# EasyEDA Pro project GD25Q40ETIGR.eprj

# Schematic Schematic1
Board Name: Board1; Create Date: 2025-05-31; Page Name: P1; Project Name: GD25Q40ETIGR; Schematic Name: Schematic1; Update Date: 2025-05-31; Company: Dawn; Drawed: Dawn; Page Size: A4; Version: V1.0
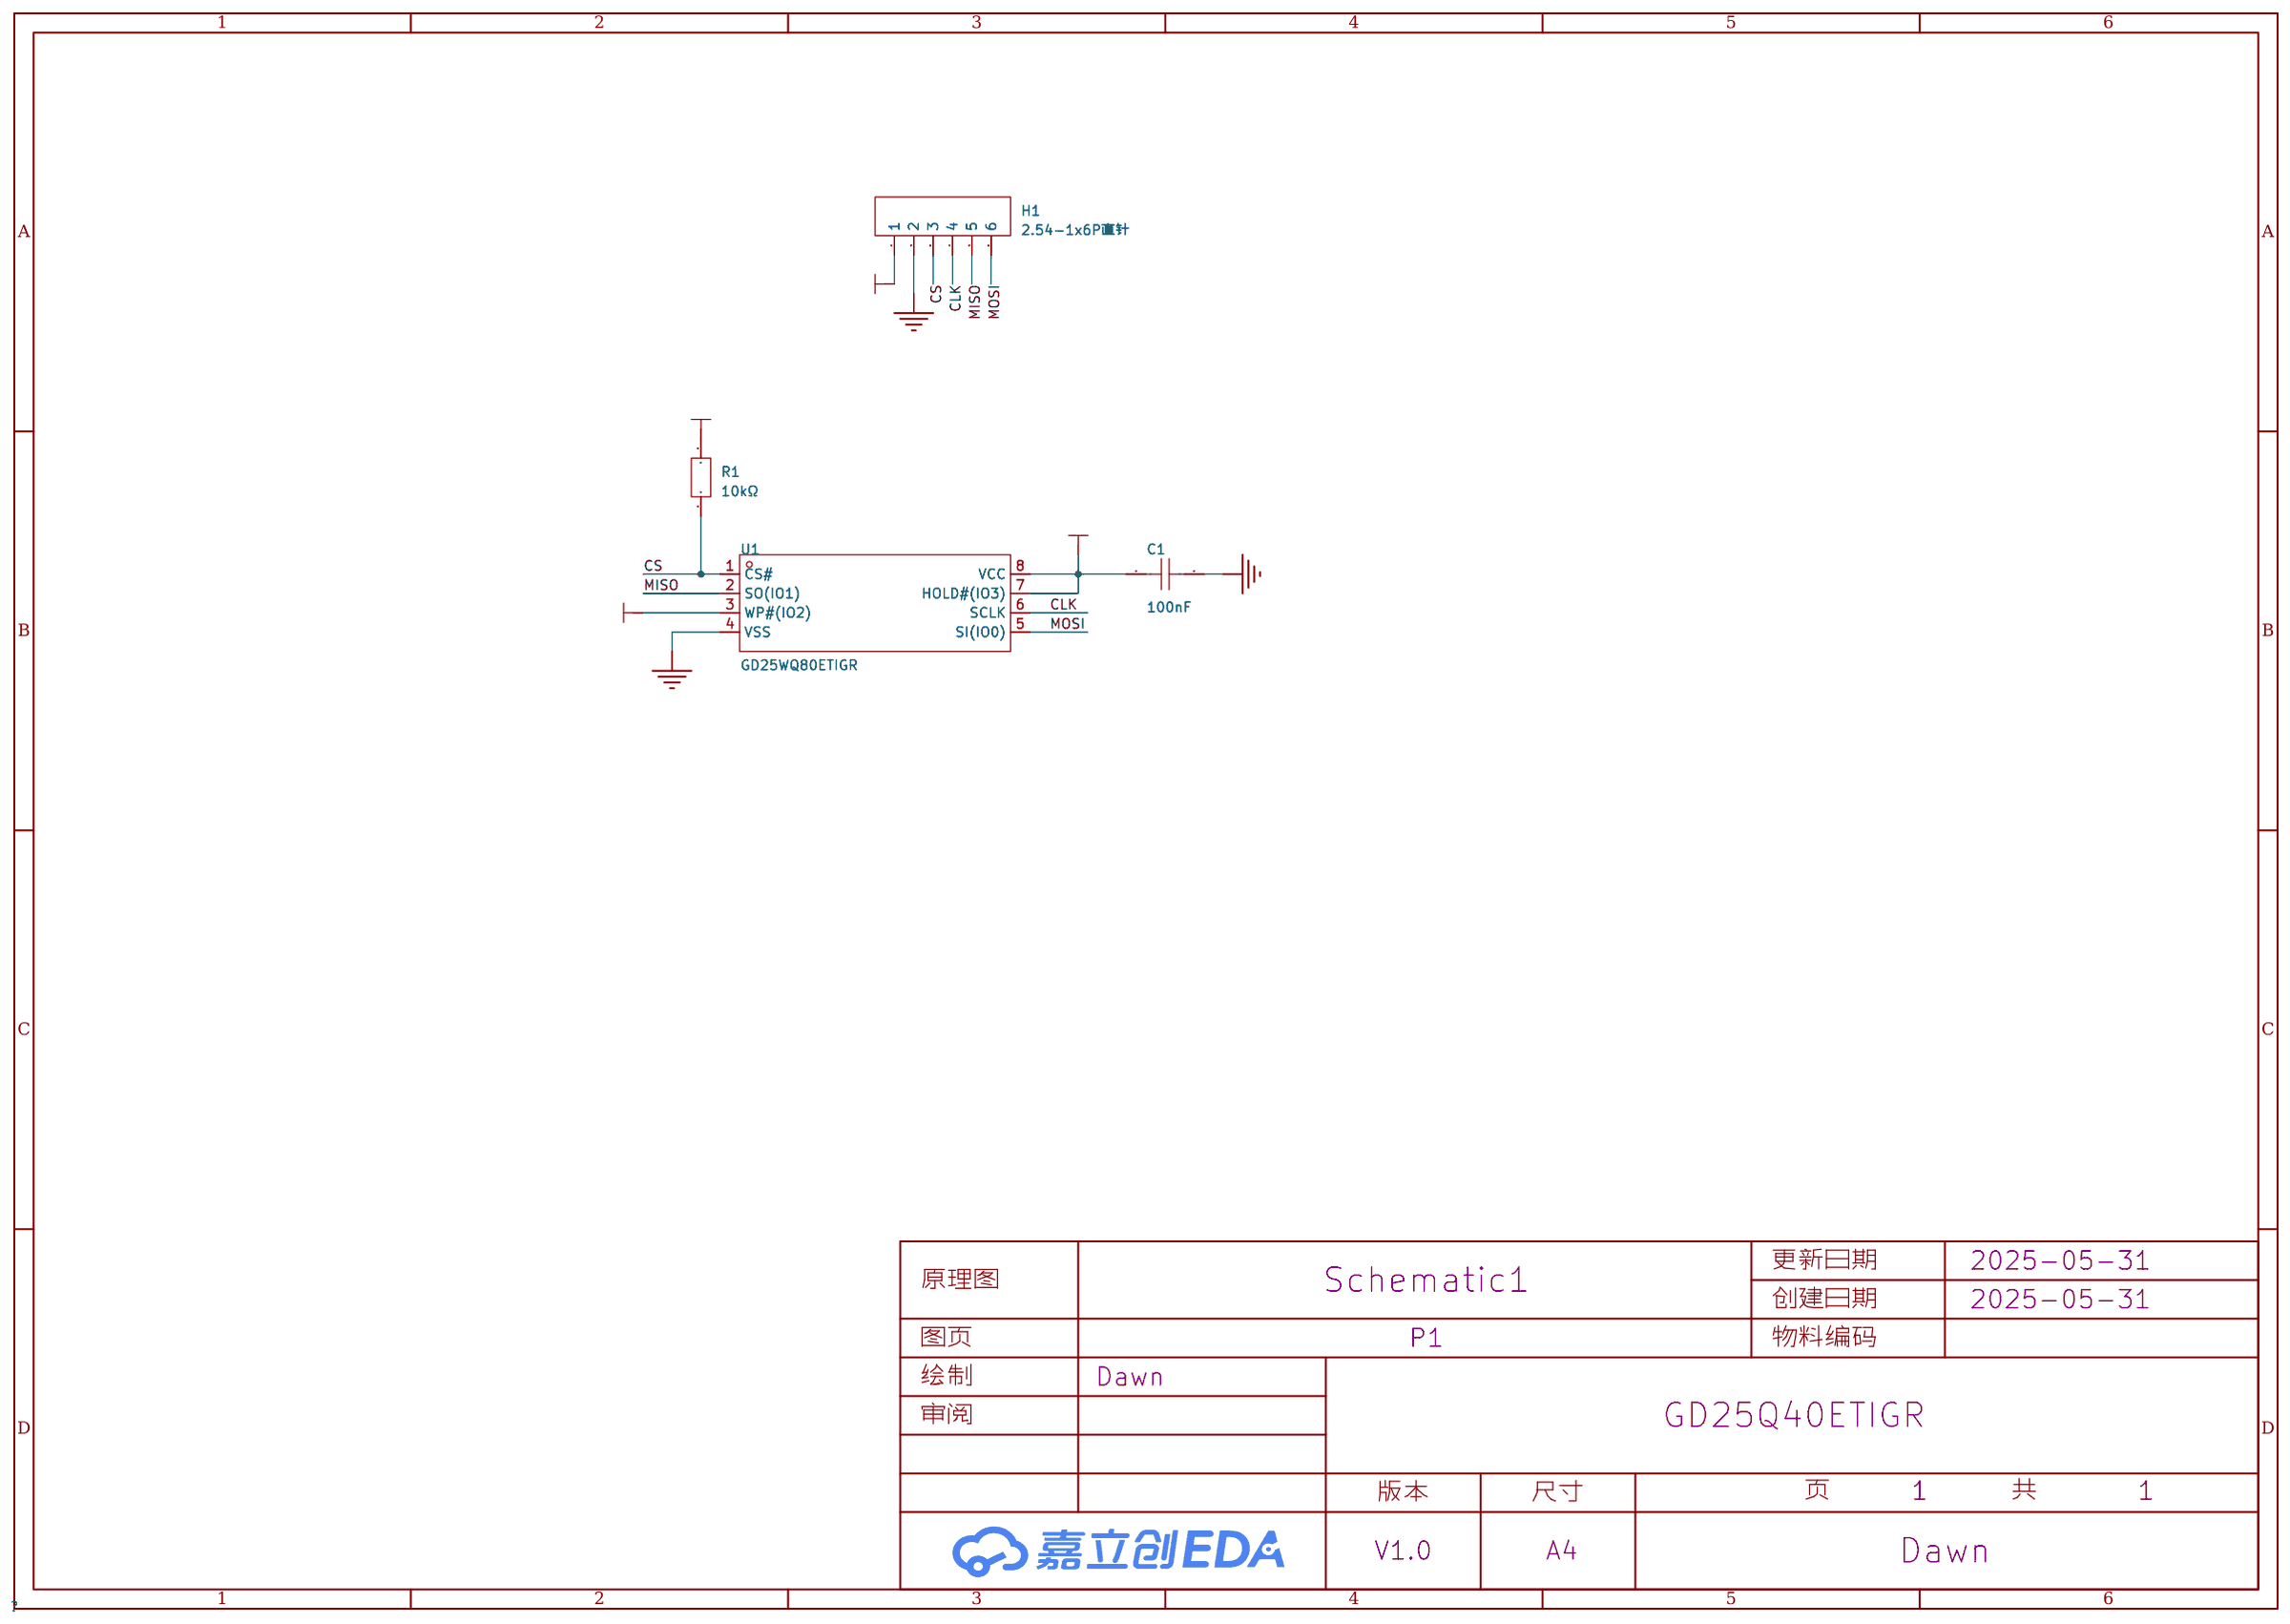
[diagram p0: schematic sheet]

## Parts
C1  100nF  [C0603]
H1  2.54-1x6P直针  [HDR-TH_6P-P2.54-V-M-1]
R1  10kΩ  [R0805]
U1  GD25WQ80ETIGR  [SOIC-8_L4.9-W3.9-P1.27-LS6.0-BL]

## Library data of the parts
C1 = CGA0603X7R104K500JT: LCSC Part Name: 100nF ±10% 50V; Supplier Part: C6119867; Manufacturer: HRE(芯声); Supplier Footprint: 0603; JLCPCB Part Class: 扩展库; Datasheet: https://atta.szlcsc.com/upload/public/pdf/source/20250103/C44077DA9E7B3EFAE02F22B6D3D1CBC9.pdf; Supplier: LCSC; Tolerance: ±10%; Voltage Rating: 50V; Temperature Coefficient: X7R
H1 = 2.54-1x6P直针: LCSC Part Name: 1x6P 间距:2.54mm 方针 直插; Supplier Part: C37208; Manufacturer: BOOMELE(博穆精密); Supplier Footprint: 插件,P=2.54mm; JLCPCB Part Class: 扩展库; Datasheet: https://atta.szlcsc.com/upload/public/pdf/source/20250115/42A019761A40C8B839643401D8CA5A96.pdf; Supplier: LCSC; Pin Structure: 1x6P; Pitch: 2.54mm; Circluar Pins/Square Pins: 方针; Mounting Type: 直插; Number of Rows: 单排; Number of Pins: 6P; Current Rating: 3A; Contact Material: 黄铜; Operating Temperature: -40℃~+105℃; Color: 黑色
R1 = AR05BTB1002: LCSC Part Name: 0805 10K ±0.1% ±10PPM 1/10W; Supplier Part: C374624; Manufacturer: Viking(光颉); Supplier Footprint: 0805; JLCPCB Part Class: 扩展库; Datasheet: https://atta.szlcsc.com/upload/public/pdf/source/20220808/FEB8974641219B05EC1DF578AF1AC27C.pdf; Supplier: LCSC; Tolerance: ±0.1%
U1 = GD25WQ80ETIGR: Supplier Part: C2904432; Manufacturer: GigaDevice(兆易创新); Supplier Footprint: SOP-8-150mil; JLCPCB Part Class: 扩展库; Datasheet: https://atta.szlcsc.com/upload/public/pdf/source/20220401/360FF1D5BDDDACF6CEA31E4AAB66E4A1.pdf; Supplier: LCSC; Memory Size: 8Mbit; Clock Frequency (fc): 104MHz; Supply Voltage: 1.65V~3.6V; Operating Temperature: -40℃~+85℃

## Nets
3V3: C1.1 H1.1 R1.2 U1.3(WP#(IO2)) U1.7(HOLD#(IO3)) U1.8(VCC)
GND: C1.2 H1.2 U1.4(VSS)
CLK: H1.4 U1.6(SCLK)
CS: H1.3 R1.1 U1.1(CS#)
MISO: H1.5 U1.2(SO(IO1))
MOSI: H1.6 U1.5(SI(IO0))

# Board PCB1
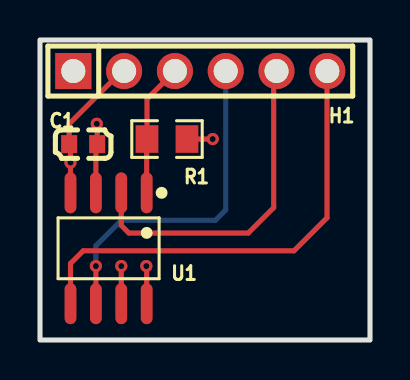
[diagram p1: board, top side]
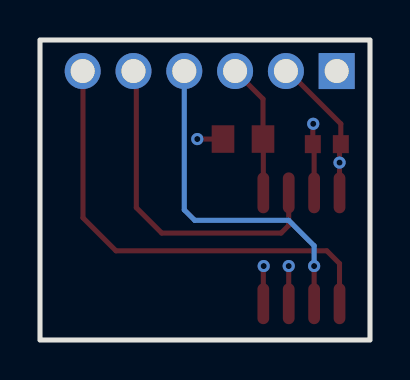
[diagram p2: board, bottom side, seen from below]

Outline 16.5 x 15 mm; copper layers: Top Layer, Inner1, Inner2, Bottom Layer. Coordinates in mm from the lower left corner of the outline.
Outline path: rectangle 0,15 16.5,0
Stack: Top Layer 0.035mm 外层铜厚1oz / Dielectric1 0.2104mm 7628 RC49% 8.6mil / Inner1 0.0152mm 内层铜厚 / Dielectric2 1.065mm 1.1mm H/HOZ Copper / Inner2 0.0152mm 内层铜厚 / Dielectric3 0.2104mm 7628 RC49% 8.6mil / Bottom Layer 0.035mm 外层铜厚1oz

## Design rules (mm)
template: JLCPCB Capability(Two Layers Board)
spacing copperThickness1oz (default): track to track 0.102, other pairs 0.152 to 0.3
spacing copperThickness2oz: track to track 0.203, other pairs 0.152 to 0.3
track width copperThickness1oz (default): min 0.127, default 0.254, max 2.54
track width copperThickness2oz: min 0.203, default 0.254, max 2.54
differential pair differentialPair (default): width min 0.127, default 0.254, max 2.54; gap min 0.152, default 0.152
via viaSize (default): diameter min 0.5, default 0.61, max 10; hole min 0.3, default 0.305, max 6.3

## Placement (name value [footprint] x y rotation side)
C1  100nF  [C0603]  2.16 9.79 180 top
H1  2.54-1x6P直针  [HDR-TH_6P-P2.54-V-M-1]  8.02 13.45 0 top
R1  10kΩ  [R0805]  6.35 10.05 0 top
U1  GD25WQ80ETIGR  [SOIC-8_L4.9-W3.9-P1.27-LS6.0-BL]  3.43 4.59 180 top

## Footprints (pads in the part's own frame, mm; a bottom-side part is the same pattern mirrored in y, then rotated)
C0603
  rect 0.8x0.9 smd: 1(-0.7,0) 2(0.7,0)
HDR-TH_6P-P2.54-V-M-1
  rect 1.8x1.8 hole 1.2: 1(-6.35,0)
  round 1.8 hole 1.2: 2(-3.81,0) 3(-1.27,0) 4(1.27,0) 5(3.81,0) 6(6.35,0)
R0805
  rect 1.133x1.377 smd: 1(-1,0) 2(1,0)
SOIC-8_L4.9-W3.9-P1.27-LS6.0-BL
  oval 0.588x2.045 smd: 1(-1.905,-2.772) 2(-0.635,-2.772) 3(0.635,-2.772) 4(1.905,-2.772) 5(1.905,2.772) 6(0.635,2.772) 7(-0.635,2.772) 8(-1.905,2.772)

## Nets
As in the schematic.

## Via types
v1: diameter 0.61, hole 0.305, Top Layer to Bottom Layer, 6 vias

## Routing (per net, layer and track width the routed paths; a pad name or vN(x,y) marks a point on that pad's centre or on a via; arc(x,y) is an arc through that point)
3V3: length 8.5
  Top Layer w0.254: v1(5.32,3.7) 5.33,3.68 U1.8 ; U1.7 v1(4.06,3.7) ; U1.3 2.79,9.73 2.86,9.79 2.86,10.81 ; R1.2 v1(8.64,10.05)
  vias: v1(2.84,10.81)
GND: length 7.3
  Top Layer w0.254: H1.2 4.1,13.45 1.46,10.81 1.46,9.67 1.52,9.6 v1(1.52,8.87) U1.4
CLK: length 17.1
  Top Layer w0.254: U1.6 v1(2.79,3.7)
  Bottom Layer w0.254: H1.4 9.29,6.51 8.76,5.98 4.06,5.98 2.79,4.71 v1(2.79,3.7)
CS: length 6.7
  Top Layer w0.254: H1.3 5.35,12.05 R1.1 5.33,10.03 U1.1
MISO: length 16.8
  Top Layer w0.254: U1.2 4.06,5.73 4.44,5.35 10.41,5.35 11.68,6.62 11.68,13.31 H1.5
MOSI: length 23.1
  Top Layer w0.254: H1.6 14.35,13.43 14.35,6.11 12.7,4.46 2.16,4.46 1.52,3.82 U1.5

## Copper pours and planes (outline as drawn; the poured copper is in the pictures)
3V3 on Inner2: 0.16,2.81 10.41,2.81 10.54,14.7 0.16,14.7
GND on Inner1: 0.26,14.74 16.24,14.74 16.24,0.26 0.26,0.26

Small or netless copper shapes (teardrops, artwork), in the pictures only: 4 on Inner1
